# EAGLE design mk3-schield (EAGLE 9.0.1)
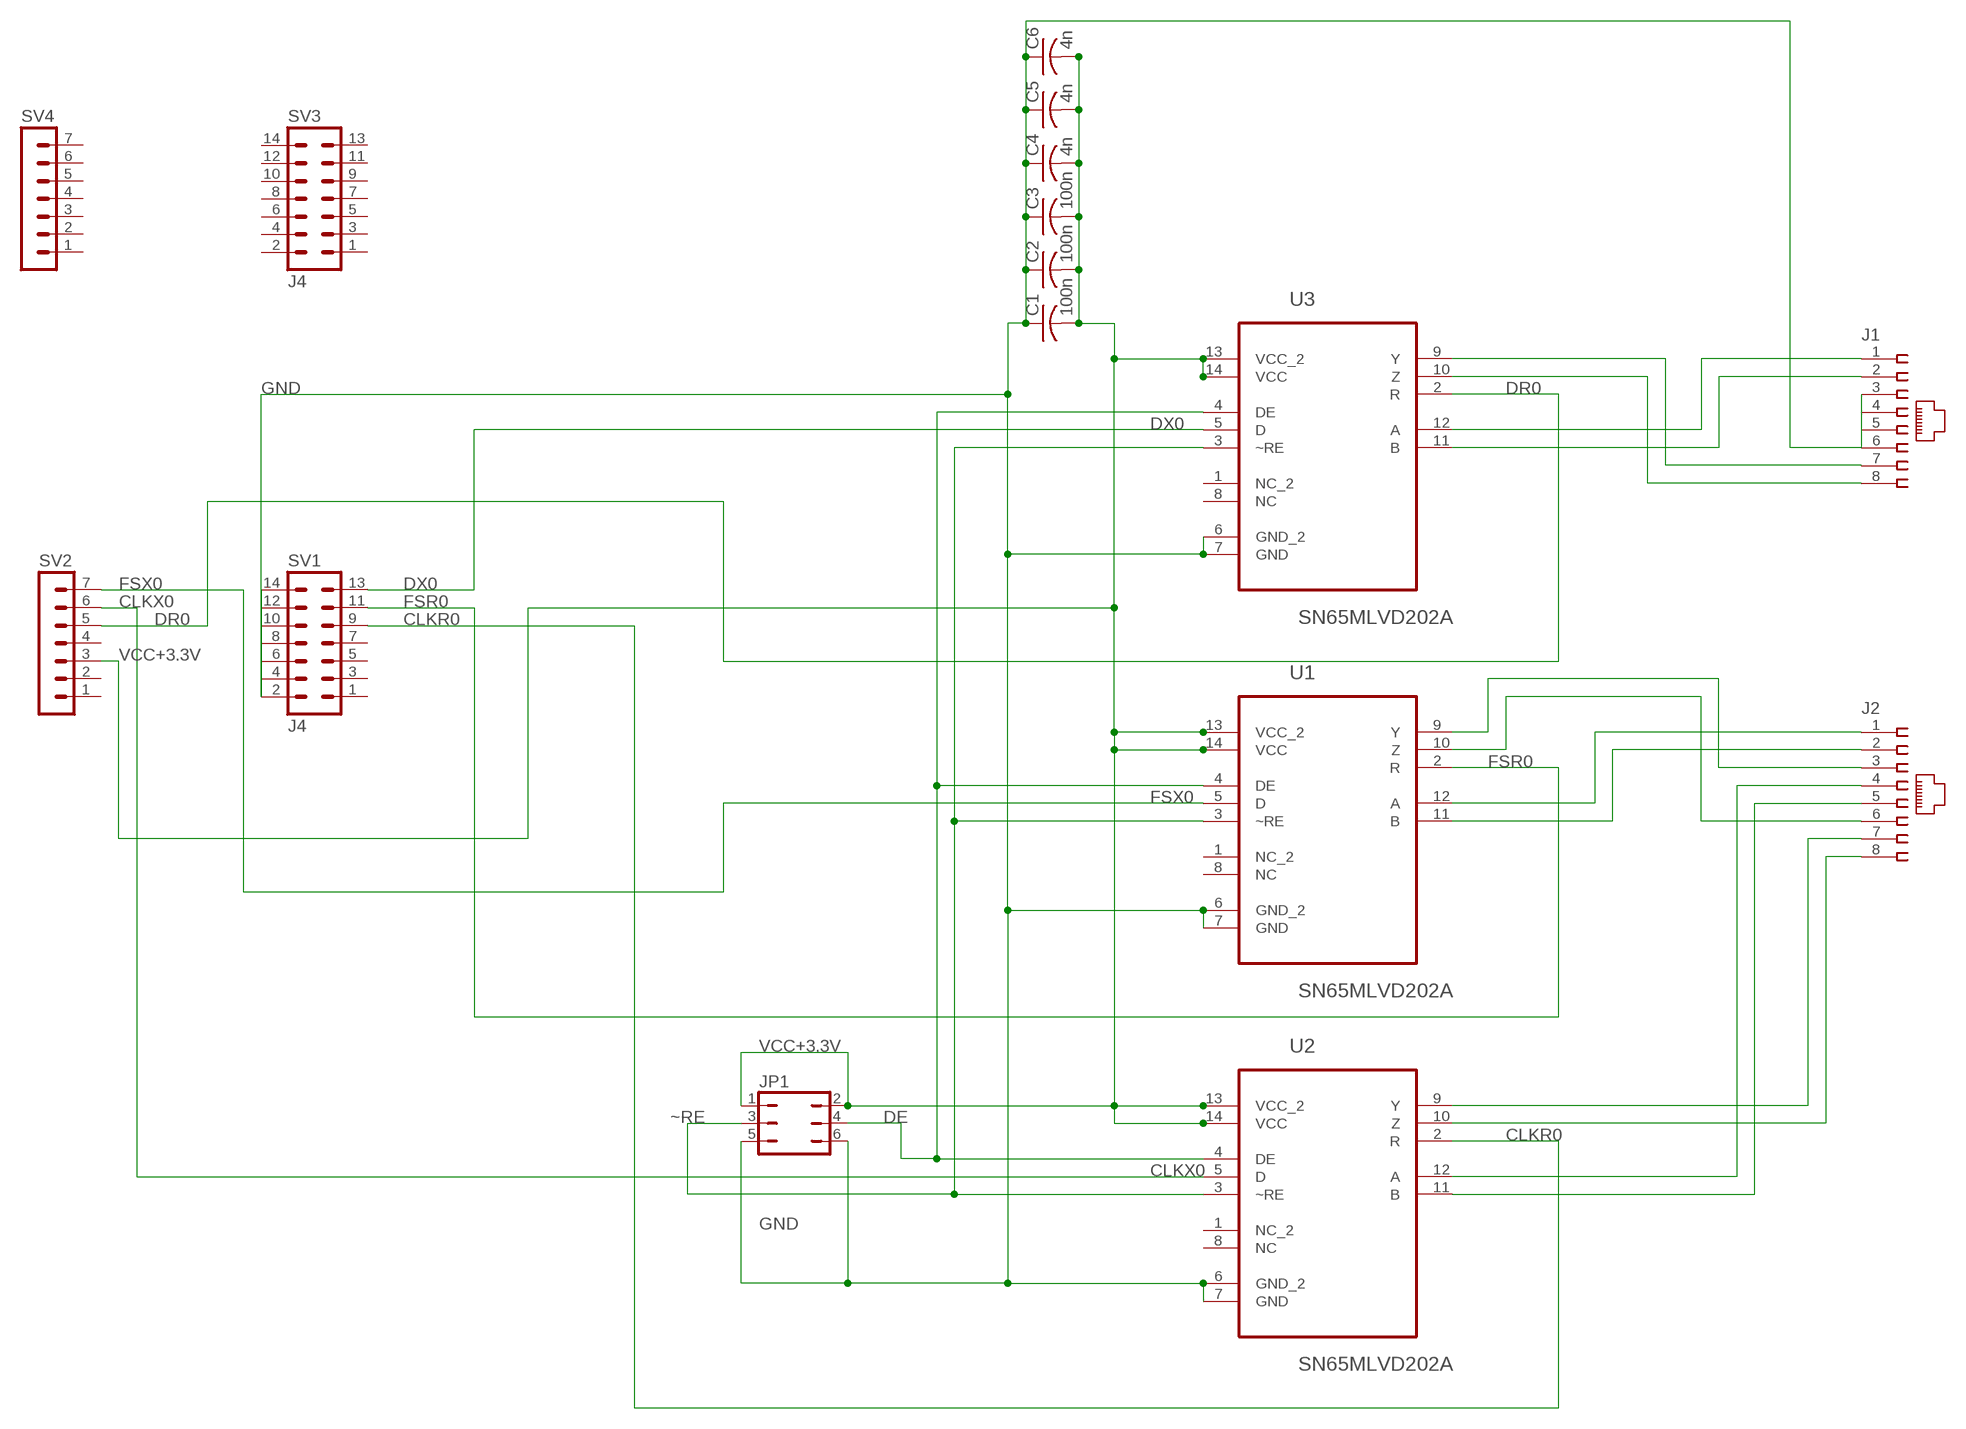
[diagram p0: schematic, sheet 1]

## Parts
C1  100n  C-USC0805  [C0805]
C2  100n  C-USC0805  [C0805]
C3  100n  C-USC0805  [C0805]
C4  4n  C-USC0805  [C0805]
C5  4n  C-USC0805  [C0805]
C6  4n  C-USC0805  [C0805]
J1  557785-1-SHIELD  [557785-1]
J2  557785-1-SHIELD  [557785-1]
JP1  JP3Q  [JP3Q]
SV1  J4  MA07-2  [MA07-2]
SV2  MA07-1  [MA07-1]
SV3  J4  MA07-2  [MA07-2]
SV4  MA07-1  [MA07-1]
U1  SN65MLVD202A  SN65MLVD205AD  [SOIC127P600X175-14N]
U2  SN65MLVD202A  SN65MLVD205AD  [SOIC127P600X175-14N]
U3  SN65MLVD202A  SN65MLVD205AD  [SOIC127P600X175-14N]

## Nets
CLKR0: SV1.9 U2.2(R)
CLKX0: SV2.6 U2.5(D)
DE: JP1.4 U1.4(DE) U2.4(DE) U3.4(DE)
DR0: SV2.5 U3.2(R)
DX0: SV1.13 U3.5(D)
FSR0: SV1.11 U1.2(R)
FSX0: SV2.7 U1.5(D)
GND: C1.1 C2.1 C3.1 C4.1 C5.1 C6.1 J1.3 J1.4 J1.5 J1.6 JP1.5 JP1.6 SV1.2 SV1.4 SV1.6 SV1.8 SV1.10 SV1.12 SV1.14 U1.6(GND_2) U1.7(GND) U2.6(GND_2) U2.7(GND) U3.6(GND_2) U3.7(GND)
N$1: J1.1 U3.12(A)
N$2: J1.2 U3.11(B)
N$3: J1.7 U3.9(Y)
N$4: J1.8 U3.10(Z)
N$5: J2.1 U1.12(A)
N$6: J2.2 U1.11(B)
N$7: J2.3 U1.9(Y)
N$8: J2.6 U1.10(Z)
N$9: J2.4 U2.12(A)
N$10: J2.5 U2.11(B)
N$11: J2.7 U2.9(Y)
N$12: J2.8 U2.10(Z)
VCC+3.3V: C1.2 C2.2 C3.2 C4.2 C5.2 C6.2 JP1.1 JP1.2 SV2.3 U1.13(VCC_2) U1.14(VCC) U2.13(VCC_2) U2.14(VCC) U3.13(VCC_2) U3.14(VCC)
~RE: JP1.3 U1.3(~RE) U2.3(~RE) U3.3(~RE)
Unconnected: SV1.1 SV1.3 SV1.5 SV1.7 SV2.1 SV2.2 SV2.4 SV3.1 SV3.2 SV3.3 SV3.4 SV3.5 SV3.6 SV3.7 SV3.8 SV3.9 SV3.10 SV3.11 SV3.12 SV3.13 SV3.14 SV4.1 SV4.2 SV4.3 SV4.4 SV4.5 SV4.6 SV4.7 U1.1(NC_2) U1.8(NC) U2.1(NC_2) U2.8(NC) U3.1(NC_2) U3.8(NC)

## Library data of the parts
C1-C6 = resistor:C-US: CAPACITOR, American symbol
J1 J2 = con-amp-rj45-shield:557785-1-SHIELD: AMP connector
JP1 = jumper:JP3Q: JUMPER
SV1 SV3 = con-lstb:MA07-2: PIN HEADER; OC_FARNELL: unknown; OC_NEWARK: unknown
SV2 SV4 = con-lstb-copy:MA07-1: PIN HEADER; OC_FARNELL: unknown; OC_NEWARK: unknown
U1-U3 = Texas Instruments_By_element14_Batch_1:SN65MLVD205AD: MULTIPOINT-LVDS LINE DRIVER AND RECEIVER; MPN: SN65MLVD205AD; OC_FARNELL: 90H3613; OC_NEWARK: -; PACKAGE: SOIC-14; SUPPLIER: TEXAS INSTRUMENTS

## Board
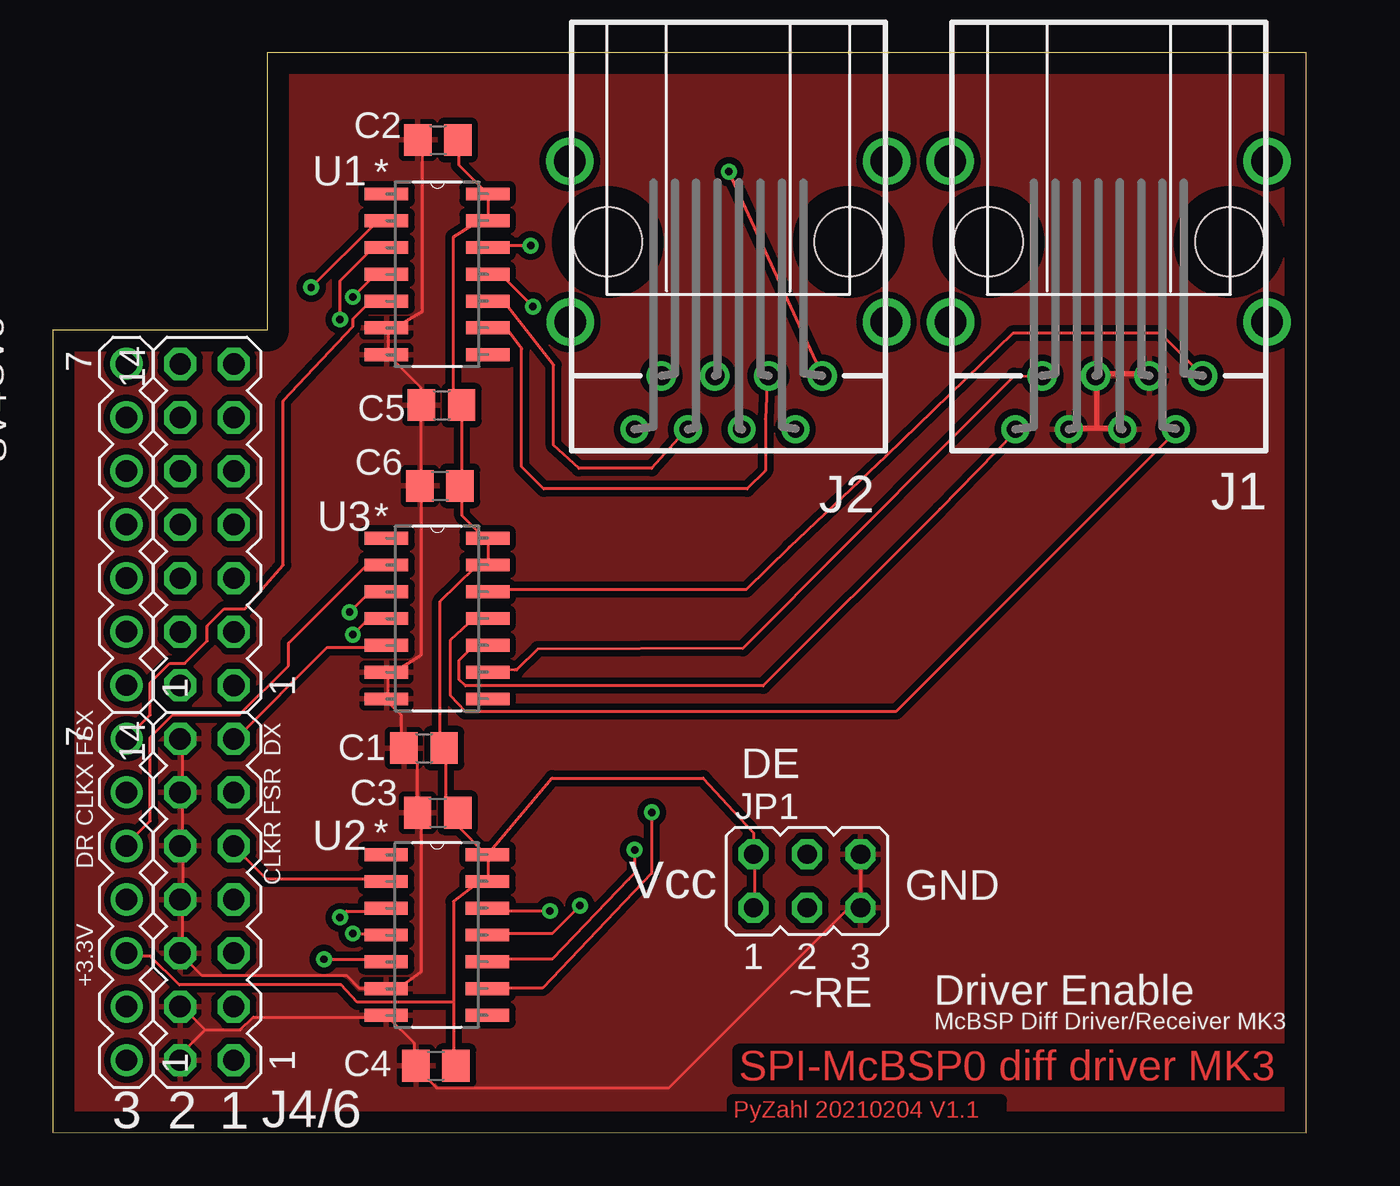
[diagram p1: board, top side]
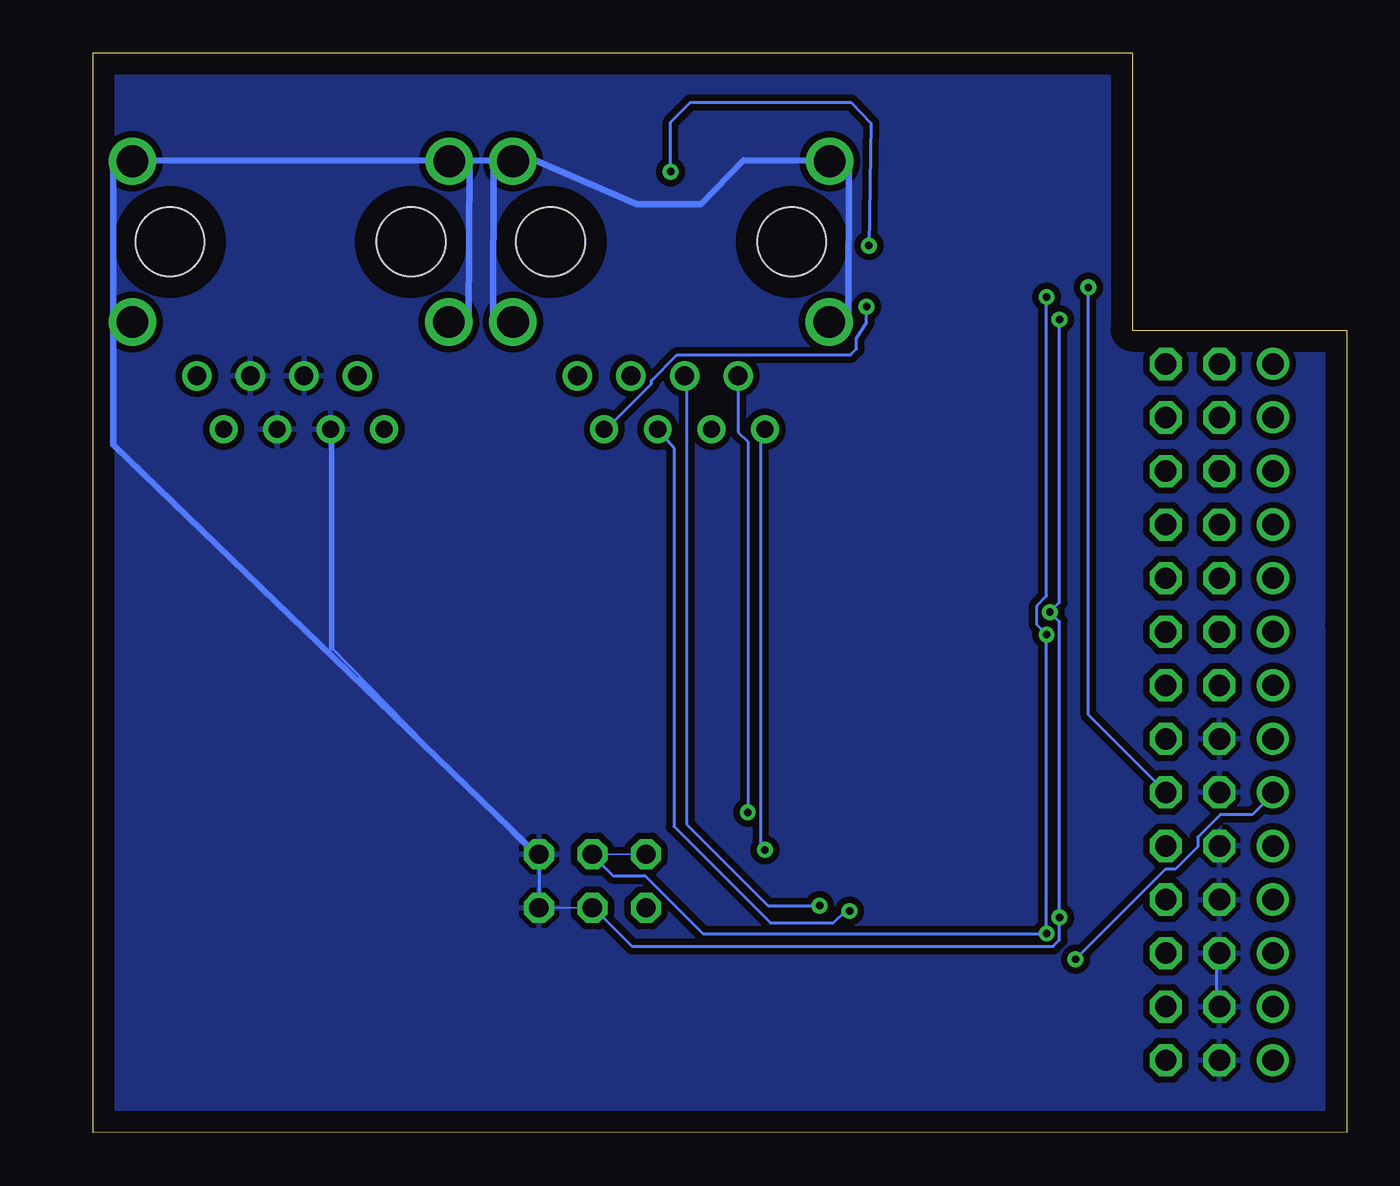
[diagram p2: board, bottom side, seen from below]

Size 59.44 x 51.21 mm. Coordinates in mm from the lower left corner, seen from the top.
Outline: 0,0.04 59.44,0 59.44,51.21 10.17,51.21 10.17,38.05 0.01,38.05 0.01,24.08 0,19.72 0,0.04
Copper layers (1*16): Top 0.035mm / dielectric 1.5mm / Bottom 0.035mm
Design rules "default": minimum track width 6mil, minimum drill 0.35mm, track to track 6mil, track to pad 6mil, pad to pad 6mil, via to via 6mil, smd to smd 6mil, copper to edge 40mil, drill to drill 6mil, minimum pad ring 10mil, minimum via ring 8mil, stop-mask expansion 4mil, vias tented up to drill 0mil, thermal gap 10mil

### Footprints (pad centres in the part's own frame; a part is rotated, then mirrored left to right if it is on the bottom)
C0805 = smd 1.3 x 1.5: 1 -0.95,0; 2 0.95,0
557785-1 = drill 0.889: 1 -4.445,6.35; 3 -1.905,6.35; 5 0.635,6.35; 7 3.175,6.35 | drill 0.813: 2 -3.175,8.89; 4 -0.635,8.89; 6 1.905,8.89; 8 4.445,8.89 | drill 1.5: P$1 -7.5,3.8; P$2 7.5,3.8; P$3 -7.5,-3.82; P$4 7.526,-3.821 | hole 3.251: -5.715,0; 5.715,0
JP3Q = drill 0.914 octagon: 1 -2.54,-1.27; 2 -2.54,1.27; 3 0,-1.27; 4 0,1.27; 5 2.54,-1.27; 6 2.54,1.27
MA07-2 = drill 1.016 octagon: 1 -7.62,-1.27; 2 -7.62,1.27; 3 -5.08,-1.27; 4 -5.08,1.27; 5 -2.54,-1.27; 6 -2.54,1.27; 7 0,-1.27; 8 0,1.27; 9 2.54,-1.27; 10 2.54,1.27; 11 5.08,-1.27; 12 5.08,1.27; 13 7.62,-1.27; 14 7.62,1.27
MA07-1 = drill 1.016: 1 -7.62,0; 2 -5.08,0; 3 -2.54,0; 4 0,0; 5 2.54,0; 6 5.08,0; 7 7.62,0
SOIC127P600X175-14N = smd 2.057 x 0.61: 1 -4.801,7.62; 2 -4.801,6.35; 3 -4.801,5.08; 4 -4.801,3.81; 5 -4.801,2.54; 6 -4.801,1.27; 7 -4.801,0; 8 0,0; 9 0,1.27; 10 0,2.54; 11 0,3.81; 12 0,5.08; 13 0,6.35; 14 0,7.62

### Placement (x,y rotation side)
C1  17.61,18.24 0 top
C2  18.26,47.07 0 top
C3  18.25,15.18 0 top
C4  18.17,3.18 0 top
C5  18.44,34.5 0 top
C6  18.36,30.67 0 top
J1  50.09,42.24 180 top
J2  32.04,42.24 180 top
JP1  35.77,11.94 0 top
SV1  7.31,11.06 90 top
SV2  3.5,11.06 90 top
SV3  7.31,28.83 90 top
SV4  3.5,28.84 90 top
U1  20.63,36.89 0 top
U2  20.61,5.57 0 top
U3  20.63,20.57 0 top

### Tracks (layer width: path | path; a pad name or v marks a point on that pad's centre or on a via)
CLKR0
  Top 0.152: U2.2 15.76,12.04 10.12,12.04 8.6,13.57 SV1.9
CLKX0  (via drill 0.35)
  Top 0.152: v12.86,8.23 15.76,8.23 U2.5
  Bottom 0.152: v12.86,8.23 8.6,12.5 8.14,12.5 7.07,13.57 7.07,14.02 6,15.09 4.48,15.09 3.57,16 SV2.6
DE  (via drill 0.35)
  Top 0.152: v14.23,9.45 15.76,9.45 U2.4 | v14.23,23.62 14.84,24.23 15.76,24.23 U3.4 | v14.23,39.63 15.3,40.69 15.76,40.69 U1.4
  Bottom 0.152: JP1.4 35.72,13.11 34.81,12.2 33.28,12.2 30.54,9.45 v14.23,9.45 v14.23,23.62 14.69,24.08 14.69,25 14.23,25.45 v14.23,39.63
DR0
  Top 0.152: U3.2 15.76,26.82 14.79,26.82 11.19,23.22 11.19,22.15 8.85,19.82 5.7,19.82 4.63,18.75 4.63,14.79 3.57,13.72 SV2.5
DX0
  Top 0.152: U3.5 15.76,23.02 13.02,23.02 8.6,18.6 SV1.13
FSR0  (via drill 0.35)
  Top 0.152: v12.25,40.08 15.3,43.13 15.76,43.13 U1.2
  Bottom 0.152: v12.25,40.08 12.25,19.82 SV1.11
FSX0
  Top 0.152: U1.5 15.76,39.32 14.97,39.32 14.25,38.61 14.24,38.23 10.93,34.7 10.93,26.93 9.1,24.84 8.14,24.84 7.33,24.03 7.33,23.32 6.26,22.25 5.55,22.25 4.63,21.34 4.63,19.82 3.57,18.75 SV2.7
GND
  Top 0.152: C2.1 17.54,46.71 17.54,38.94 16.37,38.25 15.91,38.25 U1.6 15.91,38.1 15.91,37.04 U1.7 15.91,36.88 17.43,35.36 17.43,34.6 C5.1 17.43,34.44 17.43,30.79 C6.1 17.46,30.41 17.46,22.63 16.37,21.95 15.91,21.95 U3.6 15.91,21.8 15.91,20.58 U3.7 15.91,20.42 16.52,19.82 16.52,18.29 C1.1 16.67,18.14 17.28,17.53 17.28,15.24 C3.1 17.46,14.96 17.46,7.65 16.37,6.86 15.91,6.86 U2.6 15.76,6.86 14.54,6.86 13.93,7.47 7.07,7.47 6.16,8.38 SV1.6 6.16,8.54 6.16,10.98 SV1.8 6.16,11.13 6.16,13.57 SV1.10 6.16,13.72 6.16,16 SV1.12 6.16,16.16 6.16,18.6 SV1.14 | JP1.6 JP1.5 37.75,10.67 29.22,2.14 18.2,2.14 17.28,3.05 C4.1 17.13,3.2 17.13,4.27 15.91,5.49 U2.7 15.76,5.49 9.51,5.49 8.9,4.88 7.22,4.88 | 7.22,4.88 6.16,5.95 SV1.4 | 7.22,4.88 6.16,3.81 6.16,3.51 SV1.2 | 48.3,33.4 J1.6 | 50.58,33.4 J1.4 | 49.52,36 J1.5 49.52,35.84 | 51.95,36 J1.3
  Top 0.254: 50.58,33.4 49.52,33.4 | 49.52,33.4 48.3,33.4 | 51.95,36 49.52,36 | 49.52,35.84 49.52,33.4
  Bottom 0.076: 36.39,10.66 37.69,10.67 JP1.5 arc90 JP1.5 | 38.49,46.11 arc90 38.49,46.14 40.47,46.15 41.58,46.15 | 23.61,46.1 arc-90 23.69,46.05 23.58,46.08
  Bottom 0.152: SV1.6 6.16,8.38 6.16,6.1 SV1.4 | 48.14,22.99 38.29,12.88 38.29,11.41 38.24,10.7 JP1.5 | 48.14,33.25 J1.6
  Bottom 0.254: 48.14,22.99 48.14,33.25
  Bottom 0.305: 23.58,46.08 28.6,46.11 30.62,44.02 33.67,44.02 38.49,46.11 58.51,46.08 58.51,32.62 38.24,13.03 | 23.61,46.1 23.64,38.48 | 40.47,46.15 40.48,38.49 | 41.58,46.15 41.6,46.06 41.64,38.44
  pour Top (isolate 0.305): 59.32,0.08 59.32,51.13 10.3,51.13 10.3,37.92 0.14,37.92 0.14,0.08
  pour Bottom (isolate 0.305): 59.32,0.08 59.32,51.13 10.3,51.13 10.3,37.92 -0.12,37.92 0.14,0.08
N$1
  Top 0.152: U3.12 20.64,25.76 32.88,25.76 34.94,27.77 39.51,32.08 45.53,37.9 52.54,37.9 54.47,35.97 J1.1
N$2
  Top 0.152: U3.11 20.48,24.23 20,24.41 18.86,23.37 18.86,20.73 19.57,19.97 39.99,19.97 53.25,33.23 J1.2
N$3
  Top 0.152: U3.9 21.91,21.95 22.01,21.95 23,22.94 32.73,22.96 42.56,32.84 45.6,35.89 46.85,35.82 J1.7
N$4
  Top 0.152: U3.10 20.48,23.02 20.03,23.17 19.26,22.41 19.26,21.49 19.57,21.19 33.69,21.19 42.07,29.57 45.63,33.23 J1.8
N$5  (via drill 0.35)
  Top 0.152: v22.67,42.06 20.64,42.06 U1.12 | v32.07,45.57 36.48,35.97 J2.1
  Bottom 0.152: v22.67,42.06 22.57,47.86 23.51,48.85 31.13,48.85 32.07,47.91 v32.07,45.57
N$6  (via drill 0.35)
  Top 0.152: v22.77,39.17 21.24,40.69 20.64,40.69 U1.11
  Bottom 0.152: v22.77,39.17 22.77,38.41 23.25,37.67 23.25,37.16 23.53,36.88 31.76,36.88 32.98,35.66 32.98,35.51 35.11,33.38 J2.2
N$7
  Top 0.152: U1.9 20.64,38.1 21.55,38.1 22.24,37.16 22.24,31.57 23.28,30.53 32.93,30.53 33.79,31.4 33.79,33.84 33.89,35.97 J2.3
N$8
  Top 0.152: U1.10 20.64,39.32 21.45,39.32 23.76,36.4 23.76,32.59 24.95,31.5 28.41,31.5 30.08,33.38 J2.6
N$9  (via drill 0.35)
  Top 0.152: v23.58,10.52 20.64,10.52 U2.12
  Bottom 0.152: v23.58,10.52 23.78,10.52 24.34,9.96 27.34,9.96 31.91,14.53 31.91,32.46 J2.4
N$10  (via drill 0.35)
  Top 0.152: v25,10.77 23.68,9.45 20.64,9.45 U2.11
  Bottom 0.152: v25,10.77 27.44,10.77 31.3,14.63 31.3,35.82 J2.5
N$11  (via drill 0.35)
  Top 0.152: v28.41,15.19 28.41,12.3 23.23,6.86 20.64,6.86 U2.9
  Bottom 0.152: v28.41,15.19 28.41,32.77 28.86,33.23 28.86,35.82 J2.7
N$12  (via drill 0.35)
  Top 0.152: v27.59,13.41 27.59,12.3 27.32,12.02 23.68,8.23 20.64,8.23 U2.10
  Bottom 0.152: v27.59,13.41 27.8,13.36 27.8,33.07 27.65,33.23 J2.8
VCC
  Bottom 0.076: 33.86,13.2 35.13,13.2
VCC+3.3V
  Top 0.152: 19.01,6.2 19.01,10.98 20.18,11.89 20.48,11.89 U2.13 20.64,12.04 20.64,13.11 U2.14 | 19.01,6.2 19.01,3.2 C4.2 | 19.01,6.2 14.44,6.2 13.68,7.01 6,7.01 4.63,8.38 3.57,8.38 SV2.3 | C2.2 19.26,46.94 19.26,45.88 20.48,44.66 U1.14 20.64,43.28 U1.13 20.48,43.13 20.03,43.13 19.01,42.47 19.01,34.7 C5.2 19.42,34.44 19.42,30.79 C6.2 19.42,30.64 19.42,29.26 20.48,28.2 U3.14 20.64,28.04 20.64,26.98 U3.13 20.48,26.82 20.03,26.82 18.37,25.2 18.37,18.93 C1.2 18.65,18.14 18.65,15.7 19.11,15.24 C3.2 19.26,15.09 19.26,14.48 20.48,13.26 U2.14 | JP1.1 33.28,10.67 33.28,13.11 JP1.2 33.23,14.23 33.16,14.3 30.85,16.82 23.68,16.82 U2.14
~RE  (via drill 0.35)
  Top 0.152: v13.62,10.21 13.93,10.52 15.76,10.52 U2.3 | v14.08,24.69 15,25.61 15.76,25.61 U3.3 | v13.62,38.56 13.62,40.39 15.15,41.91 15.76,41.91 U1.3
  Bottom 0.152: JP1.3 35.72,10.67 33.89,8.84 13.93,8.84 13.62,9.15 v13.62,10.21 13.62,24.23 v14.08,24.69 13.62,25.15 v13.62,38.56

### Text on the board
Top: SPI-McBSP0 diff driver MK3 | PyZahl 20210204 V1.1
tPlace: DE | Vcc | GND | ~RE | Driver Enable
tNames: FSX | DX | FSR | CLKX | DR | CLKR | +3.3V | McBSP Diff Driver/Receiver MK3 | J4/6 | 3 | 2 | 1
205bmp: /home/pzahl/BNLBox/RedPitayaPAC/Extension_connector.bmp